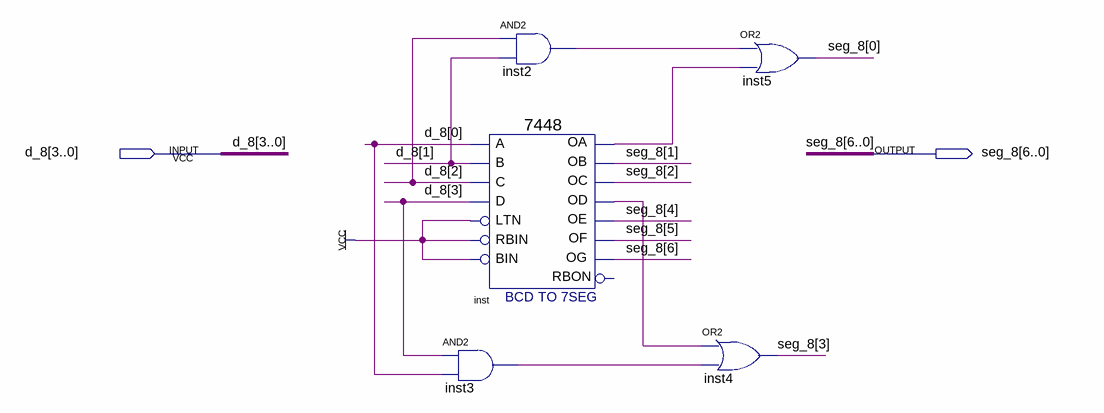
[diagram p0: schematic sheet]
// Quartus schematic decoder2_8.bdf as structural Verilog: 5 symbols, 2 pins
module decoder2_8 (
  input  [3:0] d_8,
  output [6:0] seg_8
);

  wire inst2_out, inst3_out, inst_oa, inst_od;

  \7448  inst (
    .A(d_8[0]), .C(d_8[2]), .D(d_8[3]), .B(d_8[1]), .RBIN(1'b1), .BIN(1'b1), .LTN(1'b1), .OC(seg_8[2]),
    .OE(seg_8[4]), .OD(inst_od), .OF(seg_8[5]), .OG(seg_8[6]), .OB(seg_8[1]), .OA(inst_oa));  // open: RBON
  and inst3 (inst3_out, d_8[3], d_8[0]);
  and inst2 (inst2_out, d_8[2], d_8[1]);
  or inst4 (seg_8[3], inst_od, inst3_out);
  or inst5 (seg_8[0], inst2_out, inst_oa);
endmodule
